# EAGLE design Canadian Maid v3 (EAGLE 6.5.0)
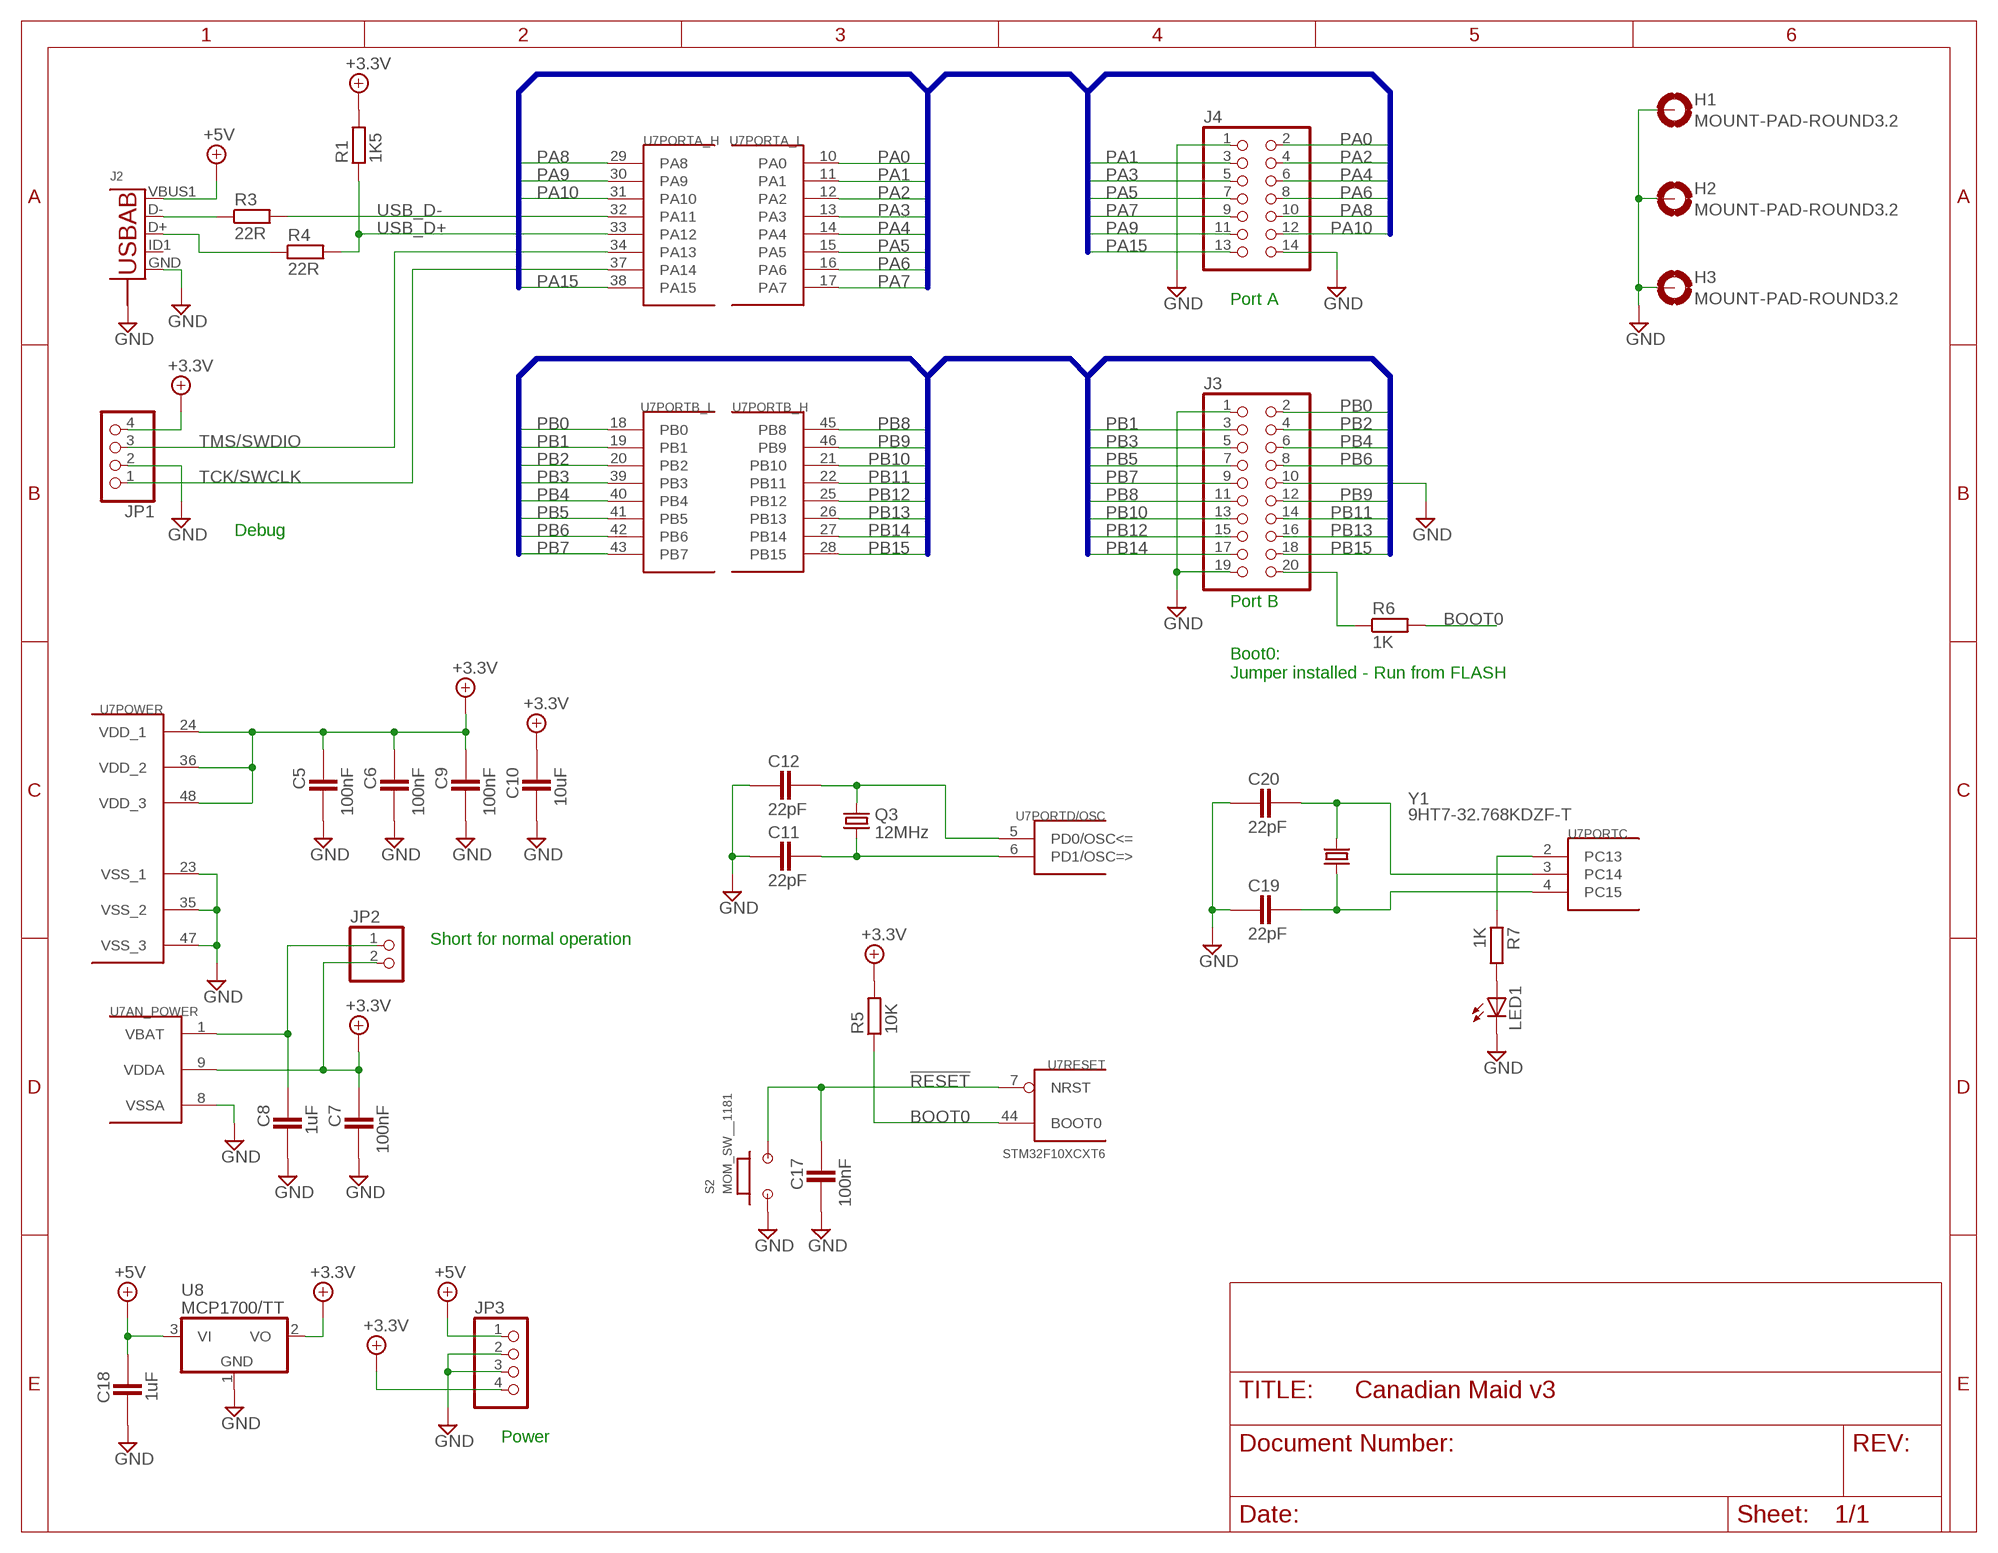
[diagram p0: schematic, sheet 1]

## Parts
C5  100nF  CAPACITOR_0402  [CAPC1005X60N]
C6  100nF  CAPACITOR_0402  [CAPC1005X60N]
C7  100nF  CAPACITOR_0402  [CAPC1005X60N]
C8  1uF  CAPACITOR_0402  [CAPC1005X60N]
C9  100nF  CAPACITOR_0402  [CAPC1005X60N]
C10  10uF  CAPACITOR_0805  [CAPC2012X145AN]
C11  22pF  CAPACITOR_0402  [CAPC1005X60N]
C12  22pF  CAPACITOR_0402  [CAPC1005X60N]
C17  100nF  CAPACITOR_0402  [CAPC1005X60N]
C18  1uF  CAPACITOR_0603  [CAPC1608X92N]
C19  22pF  CAPACITOR_0402  [CAPC1005X60N]
C20  22pF  CAPACITOR_0402  [CAPC1005X60N]
H1  MOUNT-PAD-ROUND3.2  [3,2-PAD]
H2  MOUNT-PAD-ROUND3.2  [3,2-PAD]
H3  MOUNT-PAD-ROUND3.2  [3,2-PAD]
J2  USB-ABBG  [USB-AB-MICRO-SMD_V03_SF]
J3  PINHD-2X10_2.54  [2X10]
J4  PINHD-2X7S  [2X07]
JP1  PINHD-1X4_2.54  [1X04]
JP2  PINHD-1X2_2.00  [1X02M]
JP3  PINHD-1X4_2.54  [1X04]
LED1  LEDSML0603  [SML0603]
Q3  12MHz  CRYSTALHC49U-V  [HC49U-V]
R1  1K5  RESISTOR_0402  [RESC1005X40AN]
R3  22R  RESISTOR_0402  [RESC1005X40AN]
R4  22R  RESISTOR_0402  [RESC1005X40AN]
R5  10K  RESISTOR_0402  [RESC1005X40AN]
R6  1K  RESISTOR_0402  [RESC1005X40AN]
R7  1K  RESISTOR_0402  [RESC1005X40AN]
S2  MOM_SW__1181  [MOM-1181]
U7  STM32F10XCXT6  [TQFP48]
U8  MCP1700/TT  [SOT95P280X135-3N]
Y1  9HT7-32.768KDZF-T  XTAL_9HT4  [9HT7]

## Nets
!RESET: C17.1 S2.2 U7.7(RESET:NRST)
+3.3V: C5.1 C6.1 C7.1 C9.1 C10.1 JP1.4 JP2.2 JP3.4 R1.2 R5.2 U7.9(AN_POWER:VDDA) U7.24(POWER:VDD_1) U7.36(POWER:VDD_2) U7.48(POWER:VDD_3) U8.2(VO)
+5V: C18.1 J2.VBUS1(VBUS) JP3.1 U8.3(VI)
BOOT0: R5.1 R6.2 U7.44(RESET:BOOT0)
GND: C5.2 C6.2 C7.2 C8.2 C9.2 C10.2 C11.1 C12.1 C17.2 C18.2 C19.1 C20.1 H1.B3,2(MOUNT) H2.B3,2(MOUNT) H3.B3,2(MOUNT) J2.GND J2.S1(S) J2.S2(S) J2.S3(S) J2.S4(S) J3.1 J3.10 J3.19 J4.1 J4.14 JP1.2 JP3.2 JP3.3 LED1.C S2.1 U7.8(AN_POWER:VSSA) U7.23(POWER:VSS_1) U7.35(POWER:VSS_2) U7.47(POWER:VSS_3) U8.1(GND)
N$4: J2.D- R3.1
N$6: J2.D+ R4.1
N$7: C8.1 JP2.1 U7.1(AN_POWER:VBAT)
N$8: C12.2 Q3.2 U7.5(PORTD/OSC:PD0/OSC<=)
N$9: C11.2 Q3.1 U7.6(PORTD/OSC:PD1/OSC=>)
N$10: J3.20 R6.1
N$11: C20.2 U7.3(PORTC:PC14) Y1.4
N$12: C19.2 U7.4(PORTC:PC15) Y1.1
N$13: R7.1 U7.2(PORTC:PC13)
N$14: LED1.A R7.2
PA0: J4.2 U7.10(PORTA_L:PA0)
PA1: J4.3 U7.11(PORTA_L:PA1)
PA2: J4.4 U7.12(PORTA_L:PA2)
PA3: J4.5 U7.13(PORTA_L:PA3)
PA4: J4.6 U7.14(PORTA_L:PA4)
PA5: J4.7 U7.15(PORTA_L:PA5)
PA6: J4.8 U7.16(PORTA_L:PA6)
PA7: J4.9 U7.17(PORTA_L:PA7)
PA8: J4.10 U7.29(PORTA_H:PA8)
PA9: J4.11 U7.30(PORTA_H:PA9)
PA10: J4.12 U7.31(PORTA_H:PA10)
PA15: J4.13 U7.38(PORTA_H:PA15)
PB0: J3.2 U7.18(PORTB_L:PB0)
PB1: J3.3 U7.19(PORTB_L:PB1)
PB2: J3.4 U7.20(PORTB_L:PB2)
PB3: J3.5 U7.39(PORTB_L:PB3)
PB4: J3.6 U7.40(PORTB_L:PB4)
PB5: J3.7 U7.41(PORTB_L:PB5)
PB6: J3.8 U7.42(PORTB_L:PB6)
PB7: J3.9 U7.43(PORTB_L:PB7)
PB8: J3.11 U7.45(PORTB_H:PB8)
PB9: J3.12 U7.46(PORTB_H:PB9)
PB10: J3.13 U7.21(PORTB_H:PB10)
PB11: J3.14 U7.22(PORTB_H:PB11)
PB12: J3.15 U7.25(PORTB_H:PB12)
PB13: J3.16 U7.26(PORTB_H:PB13)
PB14: J3.17 U7.27(PORTB_H:PB14)
PB15: J3.18 U7.28(PORTB_H:PB15)
TCK/SWCLK: JP1.1 U7.37(PORTA_H:PA14)
TMS/SWDIO: JP1.3 U7.34(PORTA_H:PA13)
USB_D+: R1.1 R4.2 U7.33(PORTA_H:PA12)
USB_D-: R3.2 U7.32(PORTA_H:PA11)
Unconnected: J2.ID1(USBID)

## Buses
B$1
B$2

## Notes on the sheet
- Port A
- Debug
- Port B
- Boot0: 
  Jumper installed - Run from FLASH
- Short for normal operation
- Power

## Library data of the parts
C5-C12 C17-C20 = ipc-7351-capacitor:CAPACITOR_
H1-H3 = FPGA board Rev10:MOUNT-PAD-ROUND: MOUNTING PAD, round
J2 = Misc Conn:USB-AB: This is a USB AB connector that is compatible with USB OTG. i.e. this connector can serve as a host or device
J3 = Misc Conn:PINHD-2X10: PIN HEADER
J4 = Misc Conn:PINHD-2X7: PIN HEADER
JP1 JP3 = Misc Conn:PINHD-1X4: PIN HEADER
JP2 = pinhead-1:PINHD-1X2: PIN HEADER
LED1 = led:LED: LED OSRAM: - CHIPLED LG R971, LG N971, LY N971, LG Q971, LY Q971, LO R971, LY R971 LH N974, LH R974 LS Q976, LO Q976, LY Q976 LO Q996 - Hyper CHIPLED LW Q18S LB Q993, LB Q99A, LB R99A - SideLED LS A670, LO A670, LY A670, LG A670, LP A670 LB A673, LV A673, LT A673, LW A673 LH A674 LY A675 LS A676, LA A676, LO A676, LY A676, LW A676 LS A679, LY A679, LG A679 - Hyper Micro SIDELED® LS Y876, LA Y876, LO Y876, LY Y876 LT Y87S - SmartLED LW L88C, LW L88S LB L89C, LB L89S, LG L890 LS L89K, LO L89K, LY L89K LS L896, LA L896, LO L896, LY L896 - TOPLED LS T670, LO T670, LY T670, LG T670, LP T670 LSG T670, LSP T670, LSY T670, LOP T670, LYG T670 LG T671, LOG T671, LSG T671 LB T673, LV T673, LT T673, LW T673 LH T674 LS T676, LA T676, LO T676, LY T676, LB T676, LH T676, LSB T676, LW T676 LB T67C, LV T67C, LT T67C, LS T67K, LO T67K, LY T67K, LW E67C LS E67B, LA E67B, LO E67B, LY E67B, LB E67C, LV E67C, LT E67C LW T67C LS T679, LY T679, LG T679 LS T770, LO T770, LY T770, LG T770, LP T770 LB T773, LV T773, LT T773, LW T773 LH T774 LS E675, LA E675, LY E675, LS T675 LS T776, LA T776, LO T776, LY T776, LB T776 LHGB T686 LT T68C, LB T68C - Hyper Mini TOPLED® LB M676 - Mini TOPLED Santana® LG M470 LS M47K, LO M47K, LY M47K Source: http://www.osram.convergy.de LUXEON: - LUMILED® LXK2-PW12-R00, LXK2-PW12-S00, LXK2-PW14-U00, LXK2-PW14-V00 LXK2-PM12-R00, LXK2-PM12-S00, LXK2-PM14-U00 LXK2-PE12-Q00, LXK2-PE12-R00, LXK2-PE12-S00, LXK2-PE14-T00, LXK2-PE14-U00 LXK2-PB12-K00, LXK2-PB12-L00, LXK2-PB12-M00, LXK2-PB14-N00, LXK2-PB14-P00, LXK2-PB14-Q00 LXK2-PR12-L00, LXK2-PR12-M00, LXK2-PR14-Q00, LXK2-PR14-R00 LXK2-PD12-Q00, LXK2-PD12-R00, LXK2-PD12-S00 LXK2-PH12-R00, LXK2-PH12-S00 LXK2-PL12-P00, LXK2-PL12-Q00, LXK2-PL12-R00 Source: www.luxeon.com KINGBRIGHT: KA-3528ASYC Source: www.kingbright.com
Q3 = crystal:CRYSTAL: CRYSTAL; OC_FARNELL: 1666969; OC_NEWARK: unknown
R1 R3-R7 = ipc-7351-resistor:RESISTOR_
S2 = Misc Passives:MOM_SW__: Chinese "1181" tactile switch, C&K KMT0 Tactile Switch
U7 = stm32:STM32F10XCXT6: ST STM32F101/103 48pin LQFP
U8 = Misc Power:MCP1700
Y1 = Misc Clock:XTAL_: kHz RANGE CRYSTAL UNIT LOW PROFILE SMD Source: Epson Toyocom FC-12M.pdf

## Net classes
1 diff: width 0.003 mm, drill 0.006 mm, clearance 0.007 mm

## Board
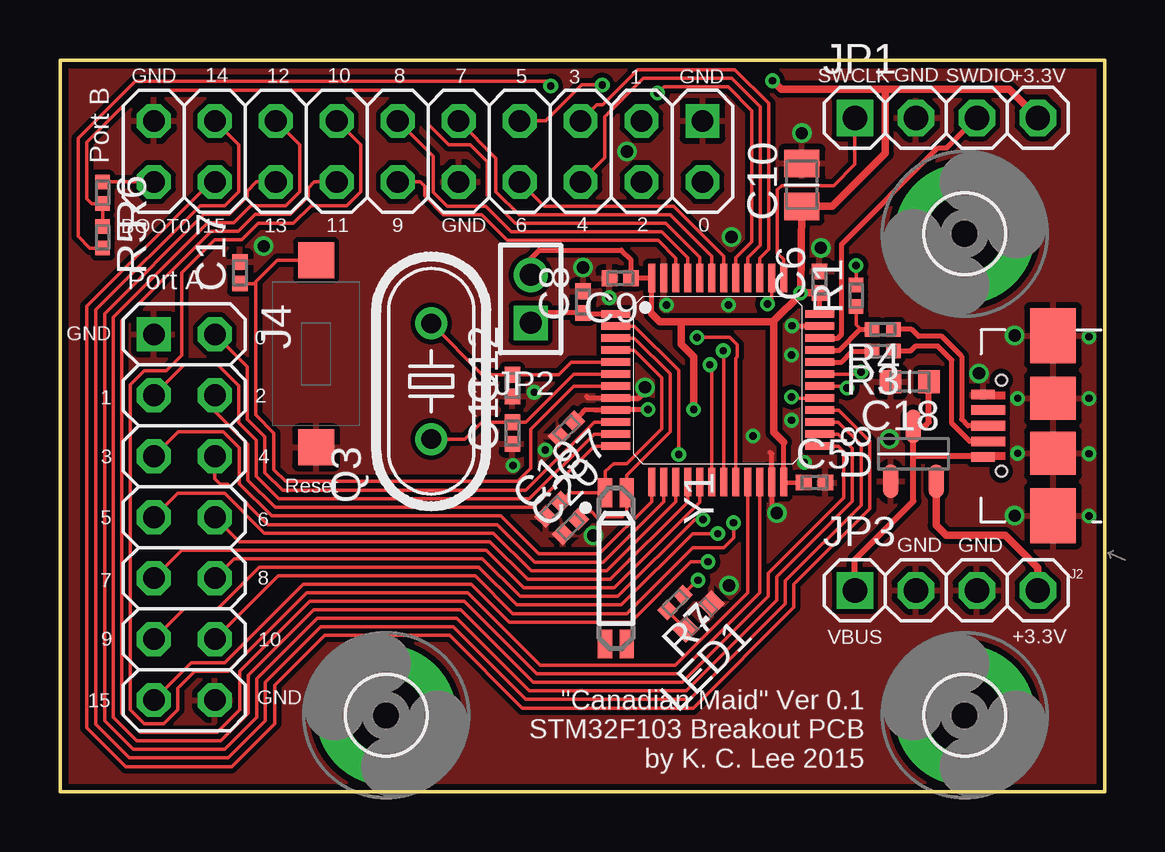
[diagram p1: board, top side]
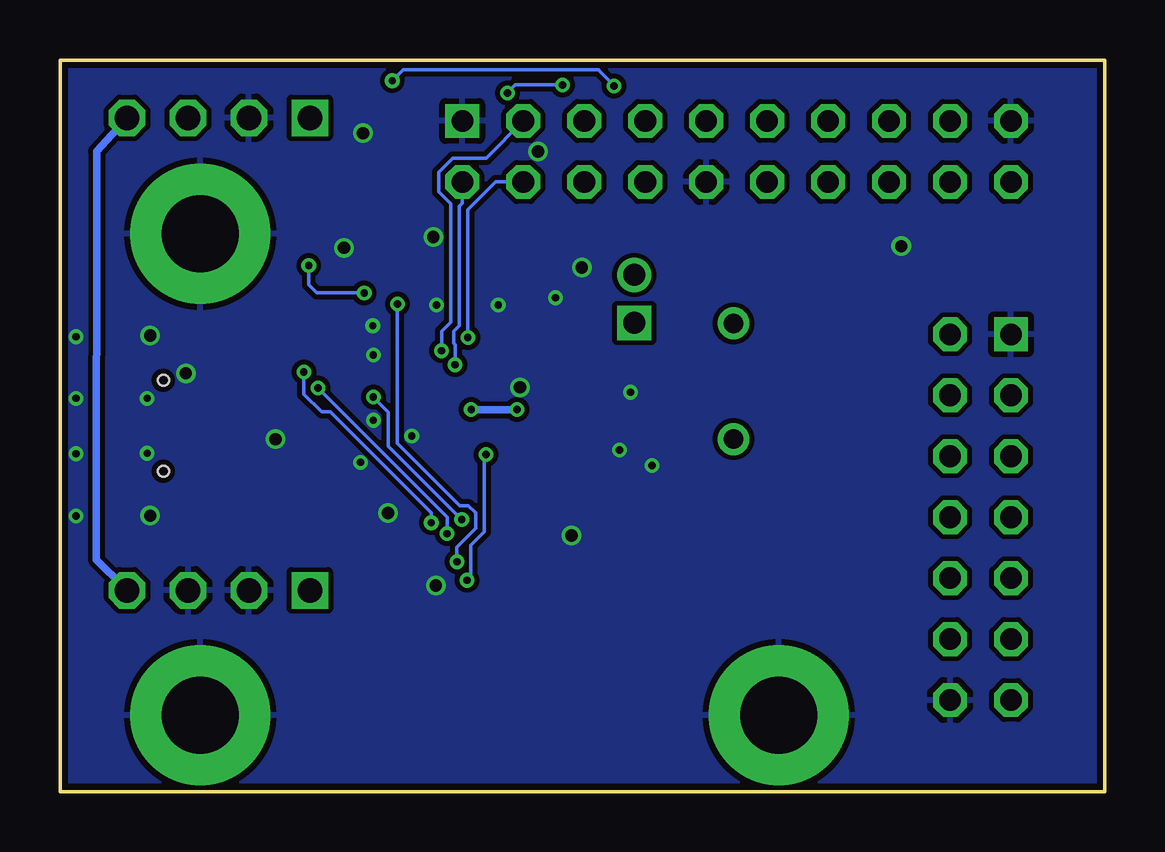
[diagram p2: board, bottom side, seen from below]

Size 43.54 x 30.48 mm. Coordinates in mm from the lower left corner, seen from the top.
Outline: 0,30.48 0,0 43.54,0 43.54,30.48 0,30.48
Copper layers (1*16): Top 0.035mm / dielectric 1.5mm / Bottom 0.035mm
Design rules "Elecrow 2-layer eagle rule": minimum track width 6mil, minimum drill 12mil, track to track 6mil, track to pad 6mil, pad to pad 6mil, via to via 6mil, smd to smd 0mil, copper to edge 10mil, drill to drill 10mil, minimum pad ring 10mil, minimum via ring 6mil, stop-mask expansion 2mil, vias tented up to drill 100mil, thermal gap 10mil

### Footprints (pad centres in the part's own frame; a part is rotated, then mirrored left to right if it is on the bottom)
CAPC1005X60N = smd 0.65 x 0.65: 1 -0.45,0; 2 0.45,0
CAPC2012X145AN = smd 1.15 x 1.45: 1 -0.9,0; 2 0.9,0
CAPC1608X92N = smd 0.9 x 0.95: 1 -0.8,0; 2 0.8,0
3,2-PAD = drill 3.2 pad 5.842: B3,2 0,0
USB-AB-MICRO-SMD_V03_SF = smd 1.4 x 0.4: D+ 2.7,0; D- 2.7,0.65; ID1 2.7,-0.65 | smd 0.975 x 0.4: GND 2.913,-1.3; VBUS1 2.913,1.3 | smd 1.9 x 2.3: S1 0,3.75; S4 0,-3.75 | smd 1.9 x 1.8: S2 0,1.15; S3 0,-1.15 | hole 0.45: 2.15,1.9; 2.15,-1.9
2X10 = drill 0.9 square: 1 -11.43,-1.27 | drill 0.9 octagon: 2 -11.43,1.27; 3 -8.89,-1.27; 4 -8.89,1.27; 5 -6.35,-1.27; 6 -6.35,1.27; 7 -3.81,-1.27; 8 -3.81,1.27; 9 -1.27,-1.27; 10 -1.27,1.27; 11 1.27,-1.27; 12 1.27,1.27; 13 3.81,-1.27; 14 3.81,1.27; 15 6.35,-1.27; 16 6.35,1.27; 17 8.89,-1.27; 18 8.89,1.27; 19 11.43,-1.27; 20 11.43,1.27
2X07 = drill 0.9 square: 1 -7.62,-1.27 | drill 0.9 octagon: 2 -7.62,1.27; 3 -5.08,-1.27; 4 -5.08,1.27; 5 -2.54,-1.27; 6 -2.54,1.27; 7 0,-1.27; 8 0,1.27; 9 2.54,-1.27; 10 2.54,1.27; 11 5.08,-1.27; 12 5.08,1.27; 13 7.62,-1.27; 14 7.62,1.27
1X04 = drill 1.016 square: 1 -3.81,0 | drill 1.016 octagon: 2 -1.27,0; 3 1.27,0; 4 3.81,0
1X02M = drill 0.914 square: 1 -1,0 | drill 0.914: 2 1,0
SML0603 = smd 0.8 x 0.8: A 0.75,0; C -0.75,0
HC49U-V = drill 0.813: 1 -2.413,0; 2 2.413,0
RESC1005X40AN = smd 0.6 x 0.6: 1 -0.45,0; 2 0.45,0
MOM-1181 = smd 1.5 x 1.5: 1 3.9,0; 2 -3.9,0
TQFP48 = smd 0.3 x 1.2: 1 -2.75,-4.25; 2 -2.25,-4.25; 3 -1.75,-4.25; 4 -1.25,-4.25; 5 -0.75,-4.25; 6 -0.25,-4.25; 7 0.25,-4.25; 8 0.75,-4.25; 9 1.25,-4.25; 10 1.75,-4.25; 11 2.25,-4.25; 12 2.75,-4.25; 25 2.75,4.25; 26 2.25,4.25; 27 1.75,4.25; 28 1.25,4.25; 29 0.75,4.25; 30 0.25,4.25; 31 -0.25,4.25; 32 -0.75,4.25; 33 -1.25,4.25; 34 -1.75,4.25; 35 -2.25,4.25; 36 -2.75,4.25 | smd 1.2 x 0.3: 13 4.25,-2.75; 14 4.25,-2.25; 15 4.25,-1.75; 16 4.25,-1.25; 17 4.25,-0.75; 18 4.25,-0.25; 19 4.25,0.25; 20 4.25,0.75; 21 4.25,1.25; 22 4.25,1.75; 23 4.25,2.25; 24 4.25,2.75; 37 -4.25,2.75; 38 -4.25,2.25; 39 -4.25,1.75; 40 -4.25,1.25; 41 -4.25,0.75; 42 -4.25,0.25; 43 -4.25,-0.25; 44 -4.25,-0.75; 45 -4.25,-1.25; 46 -4.25,-1.75; 47 -4.25,-2.25; 48 -4.25,-2.75
SOT95P280X135-3N = smd 1.4 x 0.65: 1 -1.15,0.95; 2 -1.15,-0.95; 3 1.15,0
9HT7 = smd 1.2 x 0.6: 1 -3.15,-0.45; 2 3.15,-0.45; 3 3.15,0.45; 4 -3.15,0.45

### Placement (x,y rotation side)
C5  31.44,12.87 0 top
C6  31.64,21.22 90 top
C7  21.11,15.11 225 top
C8  21.79,20.4 90 top
C9  23.34,21.39 180 top
C10  30.91,25.27 90 top
C11  18.85,14.94 90 top
C12  18.85,16.92 90 top
C17  7.49,21.62 90 top
C18  35.41,17.07 180 top
C19  20.55,11.76 45 top
C20  21.27,11.04 45 top
H1  37.69,3.17 270 top
H2  13.59,3.17 270 top
H3  37.69,23.24 180 top
J2  41.38,15.24 180 top
J3  15.34,26.67 180 top
J4  5.18,11.43 270 top
JP1  36.93,28.07 0 top
JP2  19.61,20.52 90 top
JP3  36.93,8.38 0 top
LED1  26.61,7.29 225 top
Q3  15.47,17.09 90 top
R1  33.17,20.66 90 top
R3  34.28,18.35 180 top
R4  34.28,19.25 180 top
R5  1.78,23.09 270 top
R6  1.78,24.94 270 top
R7  25.63,7.87 225 top
S2  10.67,18.24 270 top
U7  27.41,17.14 270 top
U8  35.56,14.07 90 top
Y1  23.16,9.3 270 top

### Tracks (layer width: path | path; a pad name or v marks a point on that pad's centre or on a via)
!RESET
  Top 0.152: 10.28,22.15 S2.2 9.06,22.14 8.15,21.23 8.15,21.16 | 8.15,21.16 8.15,15.7 8.91,14.94 8.91,13.41 9.4,12.93 19.07,12.93 19.61,13.46 19.61,15.09 21.42,16.89 U7.7 | C17.1 8.15,21.16
+3.3V  (via drill 0.3)
  Top 0.152: v20.45,29.4 20.26,29.59 3.14,29.59 0.76,27.22 0.76,23.13 1.25,22.64 R5.2 | R1.2 v33.17,21.92
  Top 0.203: U7.36 31.66,20.51 C6.1 | C5.1 30.91,12.87 U7.24 30.16,14.55 30.15,14.55 | 24.66,19.91 24.66,21.38 U7.48 24.12,21.39 C9.1 23.79,22.16 23.39,22.55 19.96,22.55 19.61,22.2 JP2.2 | C7.1 21.87,15.9 22.3,15.89 U7.9 v24.5,15.91
  Top 0.305: 34.39,29.26 34.39,26.59 32.18,24.38 30.92,24.38 C10.1 v30.86,20.78 | 34.39,29.26 39.55,29.26 JP1.4 | 29.74,19.58 29.74,14.96 30.15,14.55 | 29.74,19.58 25.93,19.58 | 25.93,19.58 24.99,19.58 24.66,19.91 | 34.39,29.26 30.06,29.26 v29.69,29.62 | U8.2 36.51,11.09 36.93,10.67 39.38,10.67 40.74,9.31 40.74,8.4 JP3.4 | v26.4,15.91 26.4,18.12 25.88,18.64 25.88,19.53 25.93,19.58 | 29.74,19.58 29.74,19.61 30.86,20.73 v30.86,20.78 | v30.86,20.78 C6.1
  Bottom 0.152: v20.45,29.4 21.08,30.06 21.09,30.07 29.23,30.07 v29.69,29.62 | v33.17,21.92 R1.2 32.83,20.77 30.91,20.77 v30.86,20.78
  Bottom 0.305: JP1.4 42.01,26.67 42.02,9.66 40.88,8.52 JP3.4 | v26.4,15.91 v24.5,15.91
+5V
  Top 0.254: C18.1 36.21,15.4 36.02,15.22 U8.3 35.56,13.99 | C18.1 | JP3.1 33.12,9.65 35.56,12.1 35.56,13.99 | J2.VBUS1 38.1,13.94 38.1,13.95 38.1,13.97 35.59,13.97 35.56,13.99
BOOT0
  Top 0.152: U7.44 26.66,22.26 25.25,23.67 18.97,23.67 17.8,24.84 17.8,26.24 17.09,26.95 16.2,26.95 15.34,27.81 15.34,28.57 14.71,29.21 3.28,29.21 1.12,27.05 1.12,24.69 1.31,24.49 R6.2 R5.1
GND  (via drill 0.3, 0.51)
  Top 0.203: 24.23,16.51 24.12,16.39 U7.8 22.01,16.39 21.95,16.46 | 29.74,11.66 29.66,11.74 U7.23 29.66,14.06 29.59,14.12 | U7.35 30.52,19.39 v30.5,19.41
  other vias: 28.88,14.81 39.9,16.38 39.9,14.1 27.85,20.27 25.27,20.27 30.48,15.47 31.01,13.72 22.89,20.57 42.88,16.38 42.88,14.07 42.88,11.48 42.88,18.95 34.56,14.68 29.87,11.61 27.88,8.59 27.98,23.1 23.62,26.67 30.91,27.43 39.78,11.49 39.78,19 38.29,17.42 22.23,10.67 24.37,16.84 21.79,21.83 8.48,22.72 18.87,13.59 20.22,14.22 19.76,16.64 31.7,22.66 30.48,18.19
  pour Top (isolate 0.203): 43.61,30.48 43.61,0 -0.03,0 -0.03,30.48
  pour Bottom (isolate 0.203): 43.61,30.48 43.61,0 -0.03,0 -0.03,30.48
N$4
  Top 0.203: J2.D- 37.9,14.59 37.17,15.32 37.17,15.33 37.16,15.34 37.16,17.97 36.58,18.55 35.64,18.55 35.43,18.35 R3.1
N$6
  Top 0.203: J2.D+ 37.83,15.24 37.57,15.51 37.57,18.14 36.74,18.96 35.78,18.96 35.48,19.25 R4.1
N$7
  Top 0.203: U7.1 21.82,19.89 C8.1 20.03,19.95 JP2.1
N$8
  Top 0.152: U7.5 21.3,17.89 20.78,17.37 C12.2 | C12.2 | C12.2 17.6,17.37 Q3.2
N$9
  Top 0.152: Q3.1 16.87,14.68 17.57,15.38 C11.2 19.4,15.38 21.41,17.39 U7.6
N$10
  Top 0.152: J3.20 R6.1
N$11
  Top 0.152: U7.3 23.93,18.89 25.43,17.4 25.43,14.99 23.61,13.18 Y1.4 23.61,11.65 23.42,11.46 22.35,11.46 22.15,11.66 21.89,11.66 C20.2
N$12
  Top 0.152: U7.4 23.92,18.39 25.07,17.25 25.07,15.11 23.62,13.66 23.06,13.66 22.71,13.34 Y1.1 21.23,12.45 C19.2
N$13  (via drill 0.3)
  Top 0.152: v26.58,8.8 26.56,8.8 R7.1 | U7.2 23.94,19.39 25.78,17.55 v25.78,14.05
  Bottom 0.152: v26.58,8.8 26.42,8.97 26.42,10.26 25.86,10.82 25.86,13.97 v25.78,14.05
N$14
  Top 0.152: R7.2 25.31,7.53 LED1.A
PA0
  Top 0.152: U7.10 22.25,15.39 19.41,12.55 9.27,12.55 8.53,13.28 8.53,14.78 7.8,15.52 7.8,17.7 J4.2
PA1
  Top 0.152: J4.3 5.18,17.78 6.58,17.78 7.44,16.92 7.44,15.37 8.18,14.63 8.18,13.13 9.12,12.19 19.56,12.19 22.26,14.89 U7.11
PA2
  Top 0.152: J4.4 6.48,16.48 6.48,15.82 7.82,14.48 7.82,12.98 8.97,11.84 19.71,11.84 22.27,14.39 U7.12
PA3
  Top 0.152: J4.5 4.93,14.99 6.81,14.99 7.47,14.33 7.47,12.83 8.81,11.48 18.36,11.48 19.94,9.91 22.48,9.91 24.66,12.08 U7.13
PA4
  Top 0.152: U7.14 25.16,12.08 22.63,9.55 19.79,9.55 18.21,11.12 8.66,11.12 6.99,12.8 6.68,12.8 6.45,13.03 J4.6
PA5
  Top 0.152: U7.15 25.66,12.07 22.78,9.2 19.63,9.2 18.06,10.77 8.51,10.77 6.86,12.42 4.9,12.42 J4.7
PA6
  Top 0.152: U7.16 26.16,12.06 22.94,8.84 19.48,8.84 17.91,10.41 7.47,10.41 J4.8
PA7
  Top 0.152: U7.17 26.66,12.05 23.09,8.48 19.33,8.48 17.75,10.06 5.08,10.06 J4.9
PA8  (via drill 0.3)
  Top 0.152: v30.48,16.43 30.5,16.41 30.67,16.39 U7.29 | J4.10 7.26,9.7 17.6,9.7 19.18,8.13 23.24,8.13 26.44,11.33 v26.8,11.33
  Bottom 0.152: v30.48,16.43 29.86,15.81 29.86,14.38 v26.8,11.33
PA9  (via drill 0.3)
  Top 0.152: U7.30 32.71,16.89 v32.79,16.82 | J4.11 5.18,7.62 6.58,7.62 8.31,9.35 17.45,9.35 19.02,7.77 23.39,7.77 26.36,10.74 v27.41,10.74
  Bottom 0.152: v32.79,16.82 27.41,11.43 v27.41,10.74
PA10  (via drill 0.3)
  Top 0.152: U7.31 33.3,17.39 v33.38,17.48 | J4.12 9.09,8.99 17.3,8.99 18.87,7.42 23.62,7.42 26.36,10.16 27.66,10.16 28.07,10.57 v28.07,11.2
  Bottom 0.152: v33.38,17.48 33.38,16.56 32.64,15.82 32.28,15.82 28.07,11.61 v28.07,11.2
PA15  (via drill 0.3)
  Top 0.152: U7.38 29.66,20.49 v29.48,20.31 | J4.13 5.46,5.36 6.86,5.36 10.13,8.64 17.14,8.64 18.72,7.06 23.77,7.06 26.29,9.58 v27,9.58
  Bottom 0.152: v29.48,20.31 29.48,14.52 26.87,11.91 26.52,11.91 26.21,11.61 26.21,10.97 27,10.19 v27,9.58
PB0  (via drill 0.3)
  Top 0.152: U7.18 27.16,17.7 v27.08,17.78
  Bottom 0.152: v27.08,17.78 27.08,18.62 27.13,18.67 27.13,19.18 26.9,19.41 26.9,24.38 26.77,24.51 J3.2
PB1  (via drill 0.3)
  Top 0.152: U7.19 27.66,18.34 v27.64,18.36
  Bottom 0.152: J3.3 25.78,26.39 27.18,26.39 27.76,25.81 27.76,24.99 27.25,24.49 27.25,19.56 27.64,19.18 v27.64,18.36
PB2  (via drill 0.3)
  Top 0.152: U7.20 28.16,18.05 28.22,18.11 28.22,18.62 27.91,18.92 v26.54,18.92
  Bottom 0.152: J3.4 25.38,25.4 26.54,24.23 v26.54,18.92
PB3
  Top 0.152: J3.5 22.36,28.61 22.62,28.61 24.08,30.07 28.12,30.07 29.54,28.68 29.54,22.6 29.16,22.22 U7.39
PB4
  Top 0.152: J3.6 22.71,26.42 22.71,28.12 24.31,29.72 27.99,29.72 29.18,28.52 29.18,22.76 28.66,22.23 U7.40
PB5  (via drill 0.3)
  Top 0.152: J3.7 20.24,27.94 21.74,29.44 v22.59,29.44 | v24.89,29.11 25.17,29.36 27.84,29.36 28.83,28.37 28.83,22.91 28.16,22.24 U7.41
  Bottom 0.152: v22.59,29.44 24.56,29.44 v24.89,29.11
PB6
  Top 0.152: J3.8 20.17,24.38 25.58,24.38 27.66,22.3 U7.42
PB7
  Top 0.152: J3.9 18.16,26.39 18.16,24.99 19.13,24.03 25.43,24.03 27.16,22.3 U7.43
PB8
  Top 0.152: U7.45 26.16,22.23 25.07,23.32 18.8,23.32 17.73,24.38 16.13,24.38 15.54,24.97 15.54,26.47 J3.11
PB9
  Top 0.152: U7.46 25.66,22.22 24.92,22.96 18.64,22.96 17.58,24.03 15.98,24.03 15.19,24.82 15.19,25.22 15.01,25.4 J3.12
PB10
  Top 0.152: U7.21 28.66,8.29 25.63,5.26 20.02,5.26 16.99,8.28 10.29,8.28 7.01,5 5.61,5 4.9,4.29 4.9,3.4 4.32,2.82 3.5,2.82 2.92,3.4 2.92,16.94 3.5,17.53 4.42,17.53 5.08,18.19 5.08,21.61 6.45,22.99 7.57,22.99 8.26,23.67 9.73,23.67 10.46,24.41 11.94,24.41 12.52,24.99 12.52,26.95 J3.13
PB11
  Top 0.152: J3.14 10.59,25.4 10.34,25.15 10.34,24.79 9.6,24.05 8.13,24.05 7.42,23.34 6.3,23.34 2.56,19.61 2.56,3.25 3.35,2.46 6.55,2.46 7.49,3.4 7.49,5 10.41,7.92 16.84,7.92 19.86,4.9 25.78,4.9 29.16,8.28 U7.22
PB12
  Top 0.152: U7.25 32.42,14.39 32.66,14.15 32.66,12.7 32.66,12.37 32.66,12.24 29.52,9.09 29.52,8.13 25.93,4.55 19.71,4.55 16.69,7.57 10.57,7.57 7.85,4.85 7.85,3.25 6.71,2.11 3.2,2.11 2.21,3.1 2.21,19.76 6.15,23.7 7.24,23.7 7.95,24.41 9.4,24.41 9.98,24.99 9.98,26.95 J3.15
PB13
  Top 0.152: U7.26 32.42,14.89 33.02,14.3 33.02,12.09 29.87,8.94 29.87,7.98 26.09,4.19 19.56,4.19 16.54,7.21 10.72,7.21 8.2,4.7 8.2,3.1 6.86,1.75 3.05,1.75 1.85,2.95 1.85,19.91 5.99,24.05 7.06,24.05 7.8,24.79 7.8,25.02 8.18,25.4 J3.16
PB14
  Top 0.152: U7.27 32.43,15.39 33.38,14.45 33.38,11.94 30.23,8.79 30.23,7.82 26.24,3.83 19.41,3.83 16.38,6.86 10.87,6.86 8.56,4.55 8.56,2.95 7.01,1.4 2.9,1.4 1.5,2.79 1.5,20.07 5.84,24.41 6.86,24.41 7.44,24.99 7.44,26.95 J3.17
PB15
  Top 0.152: U7.28 32.44,15.89 33.73,14.61 33.73,11.79 30.58,8.64 30.58,7.67 26.39,3.48 19.25,3.48 16.23,6.5 11.02,6.5 8.94,4.42 8.94,2.82 7.16,1.04 2.74,1.04 1.12,2.67 1.12,20.22 6.3,25.4 J3.18
TCK/SWCLK
  Top 0.152: JP1.1 33.12,26.14 32.23,25.25 30.07,25.25 29.9,25.07 29.9,22.43 30.15,22.17 30.15,21.4 U7.37
TMS/SWDIO
  Top 0.203: U7.34 32.41,18.89 32.56,19.05 32.56,22.81 36.58,26.82 36.96,26.82 JP1.3
USB_D+
  Top 0.152: 33.35,19.25 33.35,19.28 33.17,19.46 R1.1
  Top 0.203: U7.33 32.49,18.39 33.35,19.25 R4.2
USB_D-
  Top 0.203: U7.32 32.56,17.89 33.02,18.35 R3.2

### Text on the board
tPlace: GND | 14 | 12 | 10 | 8 | 7 | 5 | 3 | 1 | GND | SWCLK | GND | SWDIO | +3.3V | Port B | BOOT0 | 15 | 13 | 11 | 9 | GND | 6 | 4 | 2 | 0 | Port A | GND | 0 | 1 | 2 | 3 | 4 | 5 | Reset | 6 | GND | GND | 7 | 8 | 9 | VBUS | +3.3V | 10 | 15 | GND | "Canadian Maid" Ver 0.1 / STM32F103 Breakout PCB / by K. C. Lee 2015
tDocu: DEBUG